# EAGLE design PowerBoard (EAGLE 7.7.0)

## Sheet 1 of 2

## Sheet 2 of 2: Voltages
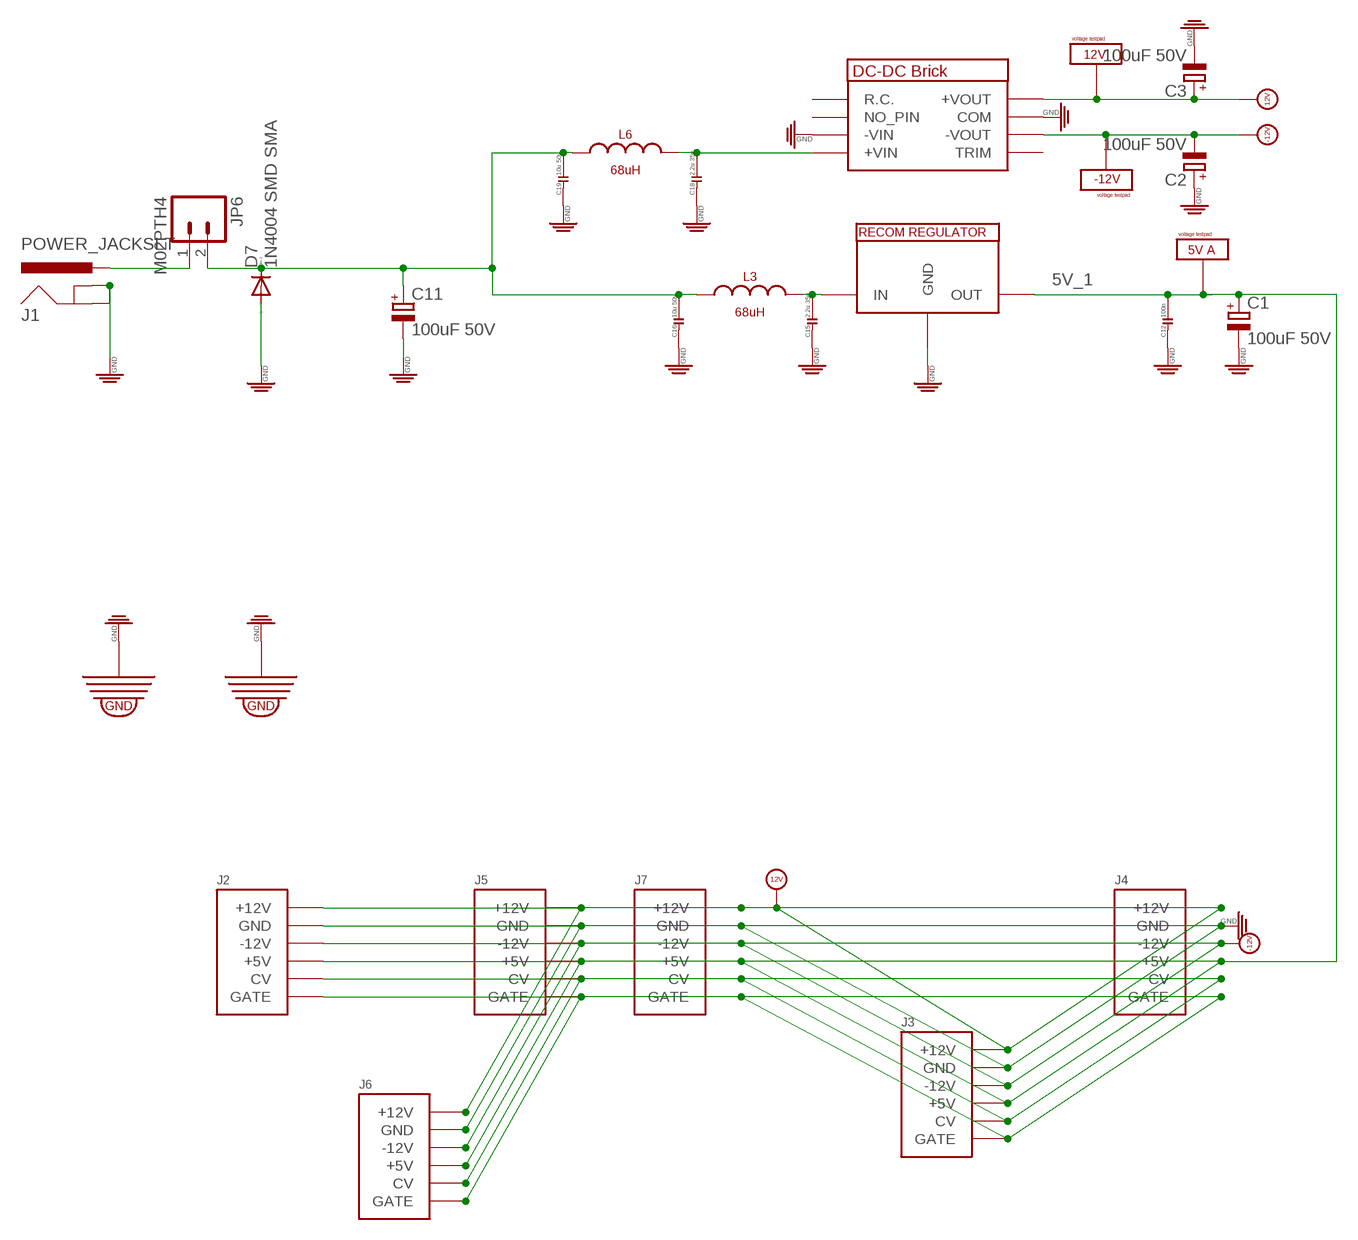
[diagram p0: schematic, sheet 2]

### Parts
C1  100uF 50V  CPOL-EU153CLV-1010  [153CLV-1010]
C2  100uF 50V  CPOL-EU153CLV-1010  [153CLV-1010]
C3  100uF 50V  CPOL-EU153CLV-1010  [153CLV-1010]
C11  100uF 50V  CPOL-EU153CLV-1010  [153CLV-1010]
C12  100n  C-0603  [C0603]
C15  2.2u 35v  C-0603  [C0603]
C16  10u 50v  C-0603  [C0603]
C18  2.2u 35v  C-0603  [C0603]
C19  10u 50v  C-0603  [C0603]
D7  1N4004 SMD SMA  DIODE-DO214AC  [DO214AC]
J1  POWER_JACKSLT  [POWER_JACK_SLOT]
J2  POWERSHROUDED  [POWER_16_SHROUDED]
J3  POWERSHROUDED  [POWER_16_SHROUDED]
J4  POWERSHROUDED  [POWER_16_SHROUDED]
J5  POWERSHROUDED  [POWER_16_SHROUDED]
J6  POWERSHROUDED  [POWER_16_SHROUDED]
J7  POWERSHROUDED  [POWER_16_SHROUDED]
JP6  M02PTH4  [1X02_XTRA_BIG]
L3  68uH  L-SWRB1204S  [SWRB120XS]
L6  68uH  L-SWRB1204S  [SWRB120XS]
U$1  DKA30  [MEANWELL_DKA30]
U$17  RECOM_REGULATOR  [R-78E5.0-1.0]
U$19  GNDLOOP  [GROUNDLOOP]
U$22  GNDLOOP  [GROUNDLOOP]
U$23  VOLTAGETESTPAD  [POWERTESTPAD]
U$25  VOLTAGETESTPAD  [POWERTESTPAD]
U$28  VOLTAGETESTPAD  [POWERTESTPAD]

### Nets
5V_1 [power]: C1.+ C12.2 J2.11(+5V) J2.12(+5V) J3.11(+5V) J3.12(+5V) J4.11(+5V) J4.12(+5V) J5.11(+5V) J5.12(+5V) J6.11(+5V) J6.12(+5V) J7.11(+5V) J7.12(+5V) U$17.P$3(OUT) U$25.P$1(VOLTAGE) U$25.P$2(VOLTAGE) U$25.P$3(VOLTAGE)
9TO18V [power]: C11.+ C16.2 C19.2 D7.C JP6.2 L3.P$1 L6.P$1
12V [power]: C3.+ J2.9(+12V) J2.10(+12V) J3.9(+12V) J3.10(+12V) J4.9(+12V) J4.10(+12V) J5.9(+12V) J5.10(+12V) J6.9(+12V) J6.10(+12V) J7.9(+12V) J7.10(+12V) U$1.P$5(+VOUT) U$23.P$1(VOLTAGE) U$23.P$2(VOLTAGE) U$23.P$3(VOLTAGE)
-12V [power]: C2.- J2.1(-12V) J2.2(-12V) J3.1(-12V) J3.2(-12V) J4.1(-12V) J4.2(-12V) J5.1(-12V) J5.2(-12V) J6.1(-12V) J6.2(-12V) J7.1(-12V) J7.2(-12V) U$1.P$7(-VOUT) U$28.P$1(VOLTAGE) U$28.P$2(VOLTAGE) U$28.P$3(VOLTAGE)
GND [power]: C1.- C2.+ C3.- C11.- C12.1 C15.1 C16.1 C18.1 C19.1 D7.A J1.GND@1(GNDBREAK) J1.GND@2(GND) J2.3(GND) J2.4(GND) J2.5(GND) J2.6(GND) J2.7(GND) J2.8(GND) J3.3(GND) J3.4(GND) J3.5(GND) J3.6(GND) J3.7(GND) J3.8(GND) J4.3(GND) J4.4(GND) J4.5(GND) J4.6(GND) J4.7(GND) J4.8(GND) J5.3(GND) J5.4(GND) J5.5(GND) J5.6(GND) J5.7(GND) J5.8(GND) J6.3(GND) J6.4(GND) J6.5(GND) J6.6(GND) J6.7(GND) J6.8(GND) J7.3(GND) J7.4(GND) J7.5(GND) J7.6(GND) J7.7(GND) J7.8(GND) U$1.P$3(-VIN) U$1.P$6(COM) U$17.P$2(GND) U$19.P$1 U$19.P$2 U$22.P$1 U$22.P$2
N$5 [power]: J1.PWR JP6.1
N$6: J2.13(CV) J2.14(CV) J3.13(CV) J3.14(CV) J4.13(CV) J4.14(CV) J5.13(CV) J5.14(CV) J6.13(CV) J6.14(CV) J7.13(CV) J7.14(CV)
N$7: J2.15(GATE) J2.16(GATE) J3.15(GATE) J3.16(GATE) J4.15(GATE) J4.16(GATE) J5.15(GATE) J5.16(GATE) J6.15(GATE) J6.16(GATE) J7.15(GATE) J7.16(GATE)
N$10 [power]: C18.2 L6.P$2 U$1.P$4(+VIN)
N$12 [power]: C15.2 L3.P$2 U$17.P$1(IN)
Unconnected: U$1.P$1(R.C.) U$1.P$2(NO_PIN) U$1.P$8(TRIM)

## Library data of the parts
C1-C3 C11 = rcl:CPOL-EU: POLARIZED CAPACITOR, European symbol
C12 C15 C16 C18 C19 = OPL:C*
D7 = diode:DIODE-: DIODE
J1 = SparkFun-Connectors:POWER_JACK: Power Jack This is the standard 5.5mm barrel jack for power. The PTH is the most common, proven, reliable, footprint. The Slot footprint only works if the mill layer is transmitted to the PCB fab house so be warned. Spark Fun Electronics SKU : PRT-00119 SMT: CONN-08106 Mating wall wart : TOL-00298 (and others)
J2-J7 = EurorackModularParts:POWER
JP6 = SparkFun-Connectors:M02: Standard 2-pin 0.1" header. Use with - straight break away headers ( PRT-00116) - right angle break away headers (PRT-00553) - swiss pins (PRT-00743) - machine pins (PRT-00117) - female headers (PRT-00115) Molex polarized connector foot print use with: PRT-08233 with associated crimp pins and housings. 2.54_SCREWTERM for use with PRT-10571. 3.5mm Screw Terminal footprints for PRT-08084 5mm Screw Terminal footprints for use with PRT-08433
L3 L6 = EurorackModularParts:L
U$1 = EurorackModularParts:DKA30
U$17 = EurorackModularParts:RECOM_REGULATOR
U$19 U$22 = FenixBase:GNDLOOP
U$23 = FenixBase:VOLTAGETESTPAD; DESC: 12V
U$25 = FenixBase:VOLTAGETESTPAD; DESC: 5V A
U$28 = FenixBase:VOLTAGETESTPAD; DESC: -12V

## Net classes
0 default: width 0.508 mm
1 power: width 1 mm
2 thin: width 0.254 mm
3 USB: width 0.254 mm, clearance 0.254 mm

## Board
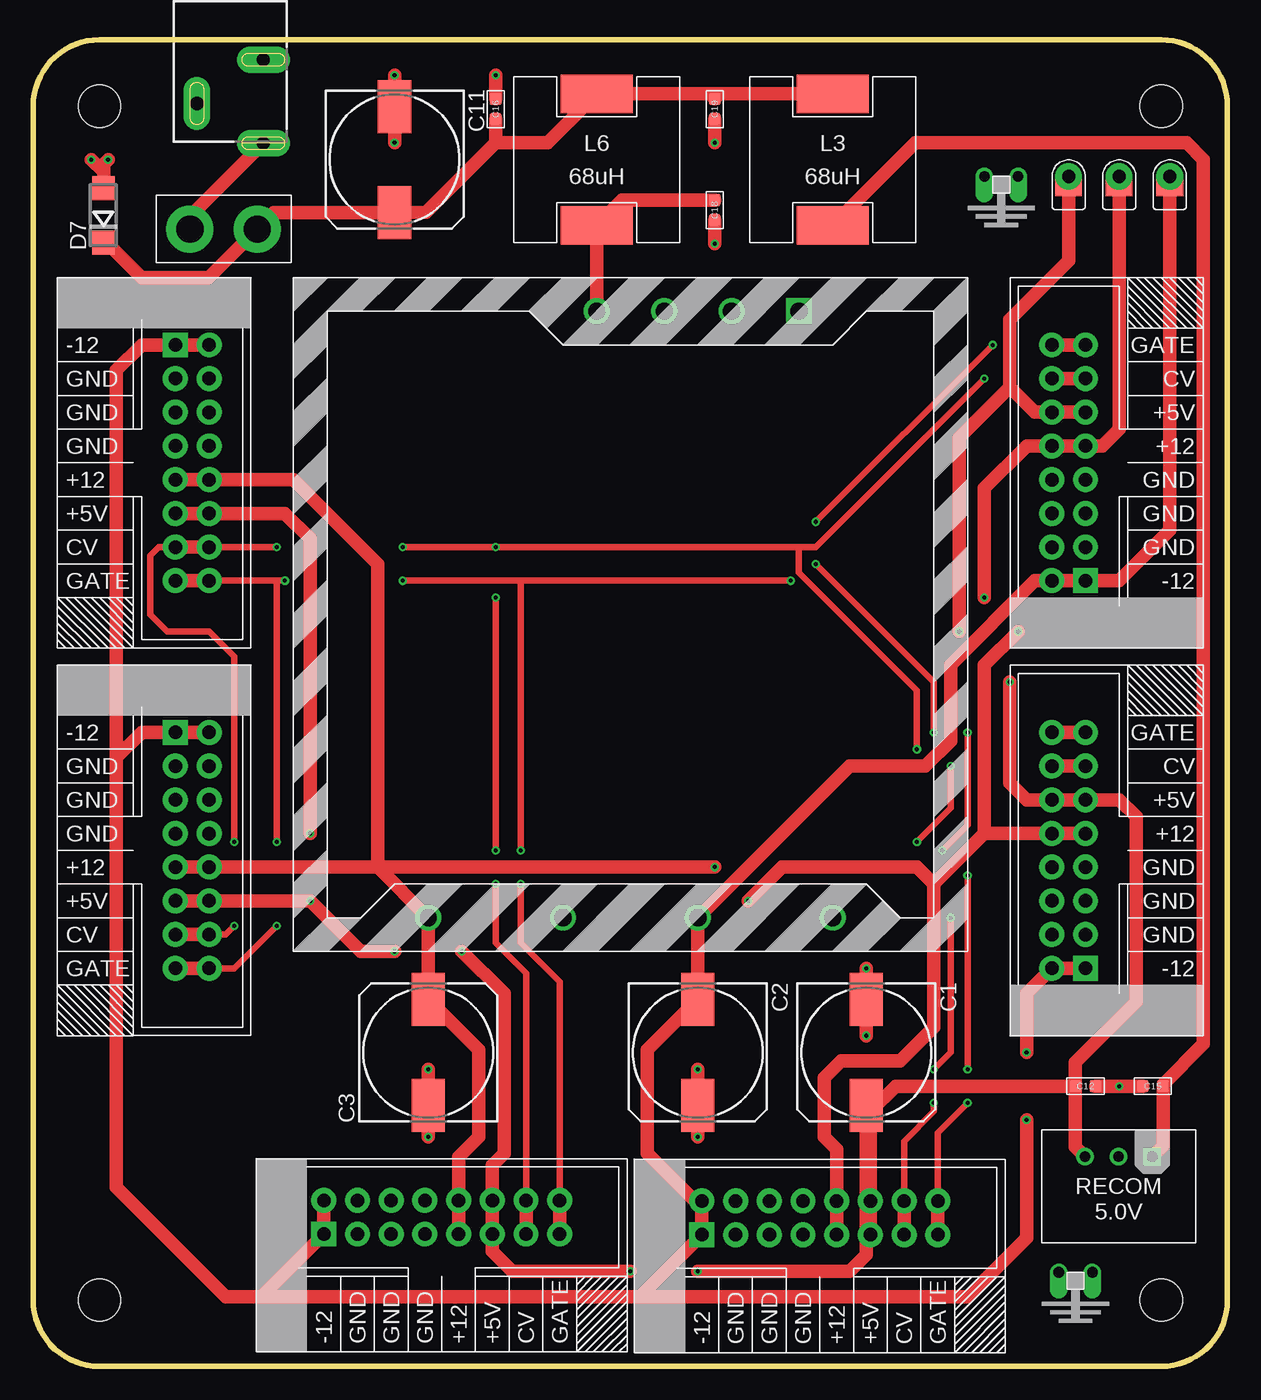
[diagram p1: board, top side]
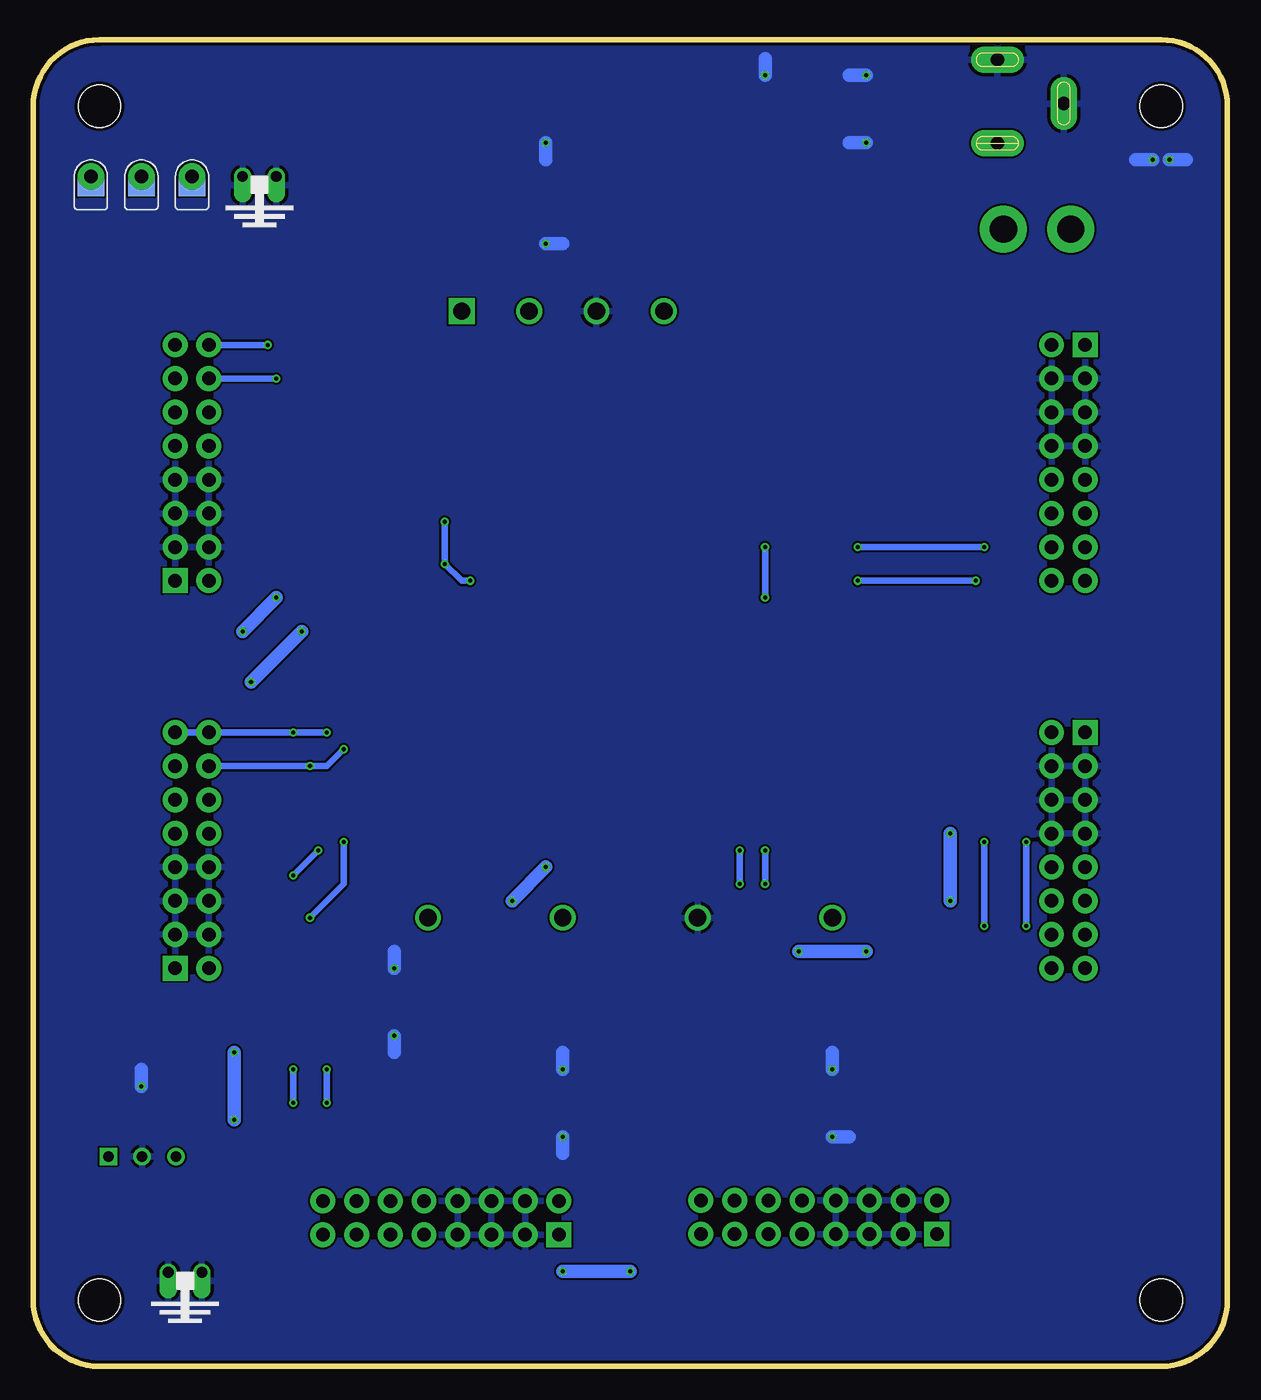
[diagram p2: board, bottom side, seen from below]

Size 90 x 100 mm. Coordinates in mm from the lower left corner, seen from the top.
Outline: 85,0 5,0 arc-90 0,5 0,95 arc-90 5,100 85,100 arc-90 90,95 90,5 arc-90 85,0
Copper layers (1*16): Top 0.035mm / dielectric 1.5mm / Bottom 0.035mm
Design rules "ITEADstudio_DRC": minimum track width 6mil, minimum drill 12mil, track to track 6mil, track to pad 6mil, pad to pad 6mil, via to via 6mil, smd to smd 0mil, copper to edge 10mil, drill to drill 10mil, minimum pad ring 10mil, minimum via ring 6mil, stop-mask expansion 2mil, vias tented up to drill 100mil, thermal gap 10mil
Holes 3.2 mm at 5,5 85,95 5,95 85,5

### Footprints (pad centres in the part's own frame; a part is rotated, then mirrored left to right if it is on the bottom)
153CLV-1010 = smd 4 x 2.5: + 4,0; - -4,0
C0603 = smd 0.889 x 0.889: 1 -0.762,0; 2 0.762,0
DO214AC = smd 1.8 x 1.7: A 2.05,0; C -2.05,0
POWER_JACK_SLOT = drill 1 pad 2 long: GND@1 2.58,7.5; GND@2 7.58,10.8; PWR 2.58,13.8
POWER_16_SHROUDED = drill 1.016 pad 1.88 square: 1 -8.89,-1.27 | drill 1.016 pad 1.88: 2 -8.89,1.27; 3 -6.35,-1.27; 4 -6.35,1.27; 5 -3.81,-1.27; 6 -3.81,1.27; 7 -1.27,-1.27; 8 -1.27,1.27; 9 1.27,-1.27; 10 1.27,1.27; 11 3.81,-1.27; 12 3.81,1.27; 13 6.35,-1.27; 14 6.35,1.27; 15 8.89,-1.27; 16 8.89,1.27
1X02_XTRA_BIG = drill 2.057 pad 3.556: 1 -2.54,0; 2 2.54,0
SWRB120XS = smd 2.9 x 5.4: P$1 -4.95,0; P$2 4.95,0
MEANWELL_DKA30 = drill 1.3 square: P$1 0,0 | drill 1.3: P$2 5.08,0; P$3 10.16,0; P$4 15.24,0; P$5 27.94,45.72; P$6 17.78,45.72; P$7 7.62,45.72; P$8 -2.54,45.72
R-78E5.0-1.0 = drill 0.8 square: P$1 -2.54,0 | drill 0.8: P$2 0,0; P$3 2.54,0
GROUNDLOOP = drill 0.8 offset: P$1 1.27,0; P$2 -1.27,0
POWERTESTPAD = drill 1 pad 2: P$1 0,0 | smd 2 x 1.5: P$2 0,-0.75 | smd 2 x 1.5 bottom: P$3 0,-0.75

### Placement (x,y rotation side)
C1  62.79,23.66 270 top
C2  50.09,23.66 270 top
C3  29.77,23.66 90 top
C11  27.23,90.97 270 top
C12  79.3,21.12 180 top
C15  84.38,21.12 0 top
C16  34.85,94.78 270 top
C18  51.36,87.16 90 top
C19  51.36,94.78 90 top
D7  5.3,86.77 90 top
J1  19.92,106 180 top
J2  78.03,38.9 90 top
J3  59.28,11.2 0 top
J4  30.79,11.24 0 top
J5  78.03,68.11 90 top
J6  11.99,68.11 270 top
J7  11.99,38.9 270 top
JP6  14.35,85.73 0 top
L3  60.25,90.97 270 top
L6  42.47,90.97 270 top
U$1  57.71,79.54 180 top
U$17  81.79,15.82 180 top
U$19  72.95,89.7 0 top
U$22  78.55,7.09 0 top
U$23  81.84,89.7 0 top
U$25  78.03,89.7 0 top
U$28  85.65,89.7 0 top

### Tracks (layer width: path | path; a pad name or v marks a point on that pad's centre or on a via)
5V_1  (via drill 0.3)
  Top 1: J3.11 J3.12 63.09,19.22 | 63.09,19.22 63.09,19.36 C1.+ 62.79,8.42 61.52,7.15 v50.09,7.15 | J6.11 J6.12 18.98,64.3 20.88,62.39 v20.88,40.17 | J7.11 J7.12 v20.88,35.09 24.69,31.28 v27.23,31.28 | J5.11 J5.12 75.49,71.92 73.58,73.83 | J2.12 J2.11 | C12.2 78.54,16.53 U$17.P$3 | U$25.P$3 78.03,83.35 73.58,78.91 73.58,73.83 | C12.2 65,21.12 63.09,19.22 | v32.31,31.28 35.48,28.11 35.48,16.04 34.6,15.16 J4.12 J4.11 34.6,8.67 36.12,7.15 v45.01,7.15 | C12.2 78.54,22.9 83.11,27.47 83.11,41.44 81.84,42.71 J2.11 | J2.11 74.86,42.71 73.58,43.98 v73.58,51.6 | v69.78,55.41 69.78,70.02 73.58,73.83
  Bottom 1: v20.88,40.17 v20.88,35.09 | v32.31,31.28 v27.23,31.28 | v50.09,7.15 v45.01,7.15 | v73.58,51.6 v69.78,55.41
9TO18V
  Top 1: 34.85,92.24 29.61,87 C11.+ 18.13,86.97 JP6.2 13.24,82.08 8.18,82.08 5.54,84.72 D7.C | 34.85,92.24 38.79,92.24 L6.P$1 50.98,95.92 | C16.2 34.85,92.24 | 50.98,95.92 C19.2 51.74,95.92 L3.P$1 | 50.98,95.92 58.85,95.92 58.98,96.05
12V  (via drill 0.3)
  Top 1: J3.9 J3.10 60.55,16.38 59.61,17.31 59.61,21.75 60.89,23.03 65.33,23.03 67.87,25.56 67.87,36.36 | J4.9 J4.10 32.06,15.79 33.58,17.31 33.58,23.85 C3.+ U$1.P$5 25.96,37.63 | J6.10 J6.9 19.61,66.84 25.96,60.49 25.96,37.63 | J7.9 J7.10 25.96,37.63 | J2.9 J2.10 71.68,40.17 | U$23.P$3 81.84,70.65 80.57,69.38 J5.9 J5.10 74.86,69.38 71.68,66.2 v71.68,57.95 | 71.68,40.17 67.87,36.36 | v74.22,55.41 71.68,52.87 71.68,40.17 | 25.96,37.63 v51.36,37.63 | v53.9,35.09 56.44,37.63 66.6,37.63 67.87,36.36
  Bottom 1: v71.68,57.95 v74.22,55.41 | v51.36,37.63 v53.9,35.09
-12V  (via drill 0.3)
  Top 1: J4.2 J4.1 17.17,5.24 | J6.2 J6.1 8.18,77 6.27,75.09 6.27,45.89 | J7.1 J7.2 8.18,47.79 6.27,45.89 | J2.1 J2.2 74.86,28.11 v74.86,23.66 | U$28.P$3 85.65,63.03 81.84,59.22 J5.1 J5.2 75.49,59.22 69.14,52.87 69.14,47.16 67.23,45.25 61.52,45.25 U$1.P$7 C2.- 46.28,23.85 46.28,16.04 49.85,12.47 J3.2 J3.1 45.7,5.24 | 6.27,45.89 6.27,13.5 14.53,5.24 17.17,5.24 | 17.17,5.24 45.7,5.24 | 45.7,5.24 70.41,5.24 74.86,9.69 v74.86,18.58
  Bottom 1: v74.86,18.58 v74.86,23.66
GND  (via drill 0.3)
  Top 1: v27.23,92.24 C11.- v27.23,97.32 | C16.1 v34.85,97.32 | v5.64,90.97 5.3,90.63 D7.A 5.3,90.04 v4.37,90.97 | C19.1 v51.36,92.24 | C18.1 v51.36,84.62 | v29.77,22.39 29.77,19.85 C3.- v29.77,17.31 | v50.09,22.39 C2.+ v50.09,17.31 | v62.79,24.93 C1.- v62.79,30.01 | C15.1 v81.84,21.12 C12.1
  Bottom 1: v27.23,92.24 28.5,92.24 | v27.23,97.32 28.5,97.32 | v34.85,97.32 34.85,98.59 | v5.64,90.97 6.91,90.97 | v4.37,90.97 3.1,90.97 | v51.36,92.24 51.36,90.97 | v51.36,84.62 50.09,84.62 | v29.77,22.39 29.77,23.66 | v29.77,17.31 28.5,17.31 | v50.09,22.39 50.09,23.66 | v50.09,17.31 50.09,16.04 | v62.79,24.93 62.79,23.66 | v62.79,30.01 62.79,31.28 | v81.84,21.12 81.84,22.39
  pour Bottom: 104.13,102 -6.28,103.22 arc87 -11.33,98.5 -17.41,-10.86 99.05,-8.32
N$5
  Top 1: JP6.1 11.81,86.67 J1.PWR
N$6  (via drill 0.3)
  Top 0.508: J6.14 v18.34,61.76 | v27.87,61.76 v34.85,61.76 57.71,61.76 | 57.71,61.76 58.98,61.76 v71.68,74.46 | v66.6,46.52 66.6,50.97 57.71,59.86 57.71,61.76 | J4.14 37.14,29.62 34.85,31.92 v34.85,36.36 | v34.85,38.9 v34.85,57.95 | J7.14 14.53,32.55 v15.16,33.19 | v15.16,39.53 15.16,53.5 13.26,55.41 10.09,55.41 8.81,56.68 8.81,61.12 9.45,61.76 J6.13 | v69.14,45.25 69.14,42.08 v66.6,39.53 | v69.14,33.82 69.14,23.66 v67.87,22.39 | v67.87,19.85 67.87,19.22 65.63,16.97 J3.14
  Top 1: J4.13 J4.14 | J3.13 J3.14 | J6.13 J6.14 | J7.13 J7.14 | J5.14 J5.13 | J2.14 J2.13
  Bottom 0.508: v18.34,61.76 v27.87,61.76 | v71.68,74.46 J5.14 | J2.14 v69.14,45.25 67.87,45.25 v66.6,46.52 | v34.85,36.36 v34.85,38.9 | v34.85,57.95 v34.85,61.76 | v15.16,33.19 v15.16,39.53 | v66.6,39.53 66.6,36.36 v69.14,33.82 | v67.87,22.39 v67.87,19.85
N$7  (via drill 0.3)
  Top 0.508: v67.87,47.79 67.87,51.6 v58.98,60.49 | v58.98,63.67 v72.31,77 | J6.16 18.34,59.22 | 18.34,59.22 v18.98,59.22 | v27.87,59.22 36.75,59.22 | 36.75,59.22 v57.08,59.22 | J4.16 39.68,28.99 36.75,31.92 v36.75,36.36 | v36.75,38.9 36.75,59.22 | J7.16 15.16,30.01 v18.34,33.19 | v18.34,39.53 18.34,59.22 | J3.15 68.17,17.61 v70.41,19.85 | v70.41,22.39 v70.41,37 | v68.5,38.9 70.41,40.81 v70.41,47.79
  Top 1: J4.15 J4.16 | J3.15 J3.16 | J6.15 J6.16 | J7.15 J7.16 | J5.16 J5.15 | J2.16 J2.15
  Bottom 0.508: J2.15 v70.41,47.79 v67.87,47.79 | v58.98,63.67 v58.98,60.49 57.71,59.22 v57.08,59.22 | v72.31,77 J5.16 | v18.98,59.22 v27.87,59.22 | v36.75,36.36 v36.75,38.9 | v18.34,33.19 v18.34,39.53 | v70.41,19.85 v70.41,22.39 | v70.41,37 v68.5,38.9
N$10
  Top 1: C18.2 44.37,87.92 L6.P$2 U$1.P$4
N$12
  Top 1: U$17.P$1 85.14,16.63 C15.2 85.14,21.25 88.19,24.3 88.19,90.97 86.92,92.24 66.47,92.24 L3.P$2